# EAGLE schematic RGB LED driver (EAGLE 7.3.0)
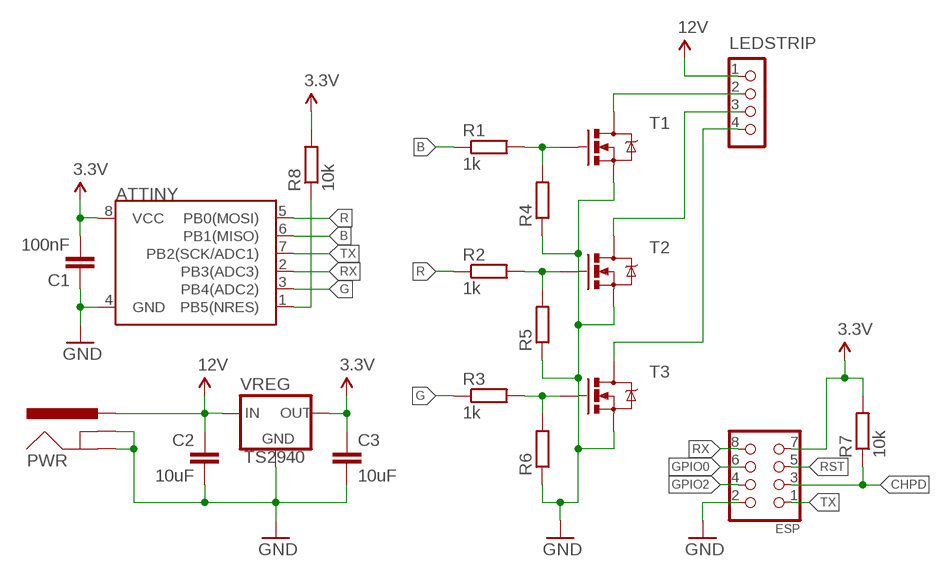
[diagram p0: schematic, sheet 1]

## Parts
ATTINY  ATTINY45TINY85-20-SMT  [SO08-EIAJ]
C1  100nF  CAP0805  [0805]
C2  10uF  CAP0805  [0805]
C3  10uF  CAP0805  [0805]
ESP  CON_HEADER_2X04-PTH  [M2X4]
LEDSTRIP  12vBRG  CON_HEADER_1X04  [M1X4]
PWR  POWER_JACKPTH  [POWER_JACK_PTH]
R1  1k  RESISTOR-0603  [R603]
R2  1k  RESISTOR-0603  [R603]
R3  1k  RESISTOR-0603  [R603]
R4  RESISTOR-0603  [R603]
R5  RESISTOR-0603  [R603]
R6  RESISTOR-0603  [R603]
R7  10k  RESISTOR-0603  [R603]
R8  10k  RESISTOR-0603  [R603]
T1  MOSFET-NCHANNELFDD8780  [DPAK]
T2  MOSFET-NCHANNELFDD8780  [DPAK]
T3  MOSFET-NCHANNELFDD8780  [DPAK]
VREG  TS2940  V_REG_MIC2920  [SOT223]

## Nets
3.3V: ATTINY.8(VCC) C1.2 C3.1 ESP.7 R7.2 R8.2 VREG.3(OUT)
12V: C2.1 LEDSTRIP.1 PWR.PWR VREG.1(IN)
B: ATTINY.6(PB1(MISO)) R1.1
CHPD: ESP.3 R7.1
G: ATTINY.3(PB4(ADC2)) R3.1
GND: ATTINY.4(GND) C1.1 C2.2 C3.2 ESP.2 PWR.GND PWR.GNDBREAK R4.1 R5.1 R6.1 T1.3(S) T2.3(S) T3.3(S) VREG.2(GND) VREG.4(GND)
GPIO0: ESP.6
GPIO2: ESP.4
N$1: R1.2 R4.2 T1.1(G)
N$2: R2.2 R5.2 T2.1(G)
N$3: R3.2 R6.2 T3.1(G)
N$4: LEDSTRIP.2 T1.4(D)
N$5: LEDSTRIP.3 T2.4(D)
N$6: LEDSTRIP.4 T3.4(D)
N$7: ATTINY.1(PB5(NRES)) R8.1
R: ATTINY.5(PB0(MOSI)) R2.1
RST: ESP.5
RX: ATTINY.2(PB3(ADC3)) ESP.8
TX: ATTINY.7(PB2(SCK/ADC1)) ESP.1

## Library data of the parts
ATTINY = SparkFun-DigitalIC:ATTINY45: Atmel 8-pin 2/4/8kB flash uC; PROD_ID: IC-09092; VALUE: Tiny85-20-SMT
C1-C3 = SparkFun-Passives:CAP: Capacitor Standard 0603 ceramic capacitor, and 0.1" leaded capacitor.
ESP = dp_devices:CON_HEADER_2X04
LEDSTRIP = dp_devices:CON_HEADER_1X04
PWR = SparkFun-Connectors:POWER_JACK: Power Jack This is the standard 5.5mm barrel jack for power. The PTH is the most common, proven, reliable, footprint. The Slot footprint only works if the mill layer is transmitted to the PCB fab house so be warned. Mating wall wart : TOL-00298 (and others); PROD_ID: CONN-08197
R1-R8 = dp_devices:RESISTOR
T1-T3 = SparkFun-DiscreteSemi:MOSFET-NCHANNEL: Common NMOSFET Parts MFG P/N Store ID Prod ID FDD8780 TRANS-09984 SI7820DN TRANS-11055 FDS6630A IC-08089 2N7002PW TRANS-11151 FQP30N06L COM-10213 TRANS-10060 BSS123LT1G TRANS-08345 BSS138 TRANS-00830 BS170 2N7000; PROD_ID: TRANS-09984
VREG = SparkFun-PowerIC:V_REG_MIC2920: MIC2920A (http://www.micrel.com/_PDF/mic2920.pdf) - 400mA output LDO Regulator